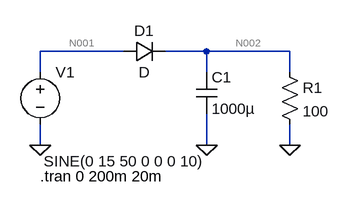
[diagram p0: schematic Draft1.asc]
Draft1.asc, the LTspice schematic file:
Version 4
SHEET 1 880 680
WIRE 144 112 16 112
WIRE 272 112 208 112
WIRE 400 112 272 112
WIRE 16 144 16 112
WIRE 272 144 272 112
WIRE 400 144 400 112
WIRE 16 256 16 224
WIRE 272 256 272 208
WIRE 400 256 400 224
FLAG 16 256 0
FLAG 272 256 0
FLAG 400 256 0
SYMBOL voltage 16 128 R0
WINDOW 3 5 153 Left 2
WINDOW 123 0 0 Left 2
WINDOW 39 0 0 Left 2
SYMATTR InstName V1
SYMATTR Value SINE(0 15 50 0 0 0 10)
SYMBOL diode 144 128 R270
WINDOW 0 32 32 VTop 2
WINDOW 3 0 32 VBottom 2
SYMATTR InstName D1
SYMBOL cap 256 144 R0
SYMATTR InstName C1
SYMATTR Value 1000µ
SYMBOL res 384 128 R0
SYMATTR InstName R1
SYMATTR Value 100
TEXT 16 304 Left 2 !.tran 0 200m 20m

The netlist it stands for:
* Draft1.asc
V1 N001 0 SINE(0 15 50 0 0 0 10)
D1 N001 N002 D
C1 N002 0 1000µ
R1 N002 0 100
.model D D
.lib standard.dio
.tran 0 200m 20m
.backanno
.end

* Results of the author's LTspice run, read from the files saved beside the schematic
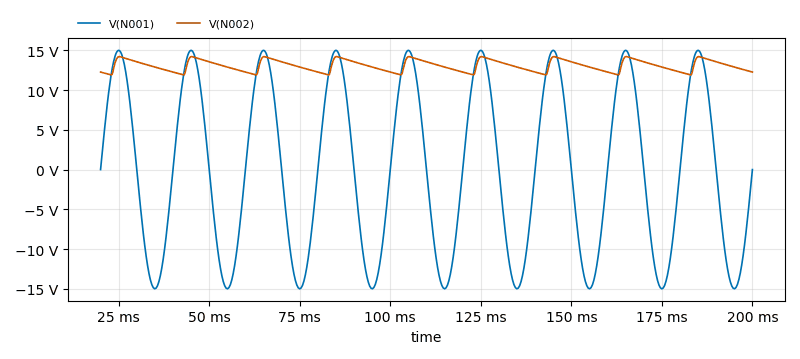
[diagram p1: Transient Analysis of Draft1.asc, plotted from the saved traces]
* Transient Analysis, 1 run:
*   V(N001): min -14.99 V, max 14.99 V, average 2.205 mV, rms 10.6 V, last 0 V
*   V(N002): min 11.9 V, max 14.2 V, average 13.05 V, rms 13.07 V, last 12.26 V